# Altium schematic sheet RevisionHistory.SchDoc: Evaluation Board 3.2
size A3; Organization: Toradex AG; Address1: Altsagenstrasse 5; Address2: Horw; Address3: 6048; Address4: Switzerland; DocumentNumber: 1; Revision: V3.2; SheetNumber: 1; SheetTotal: 23
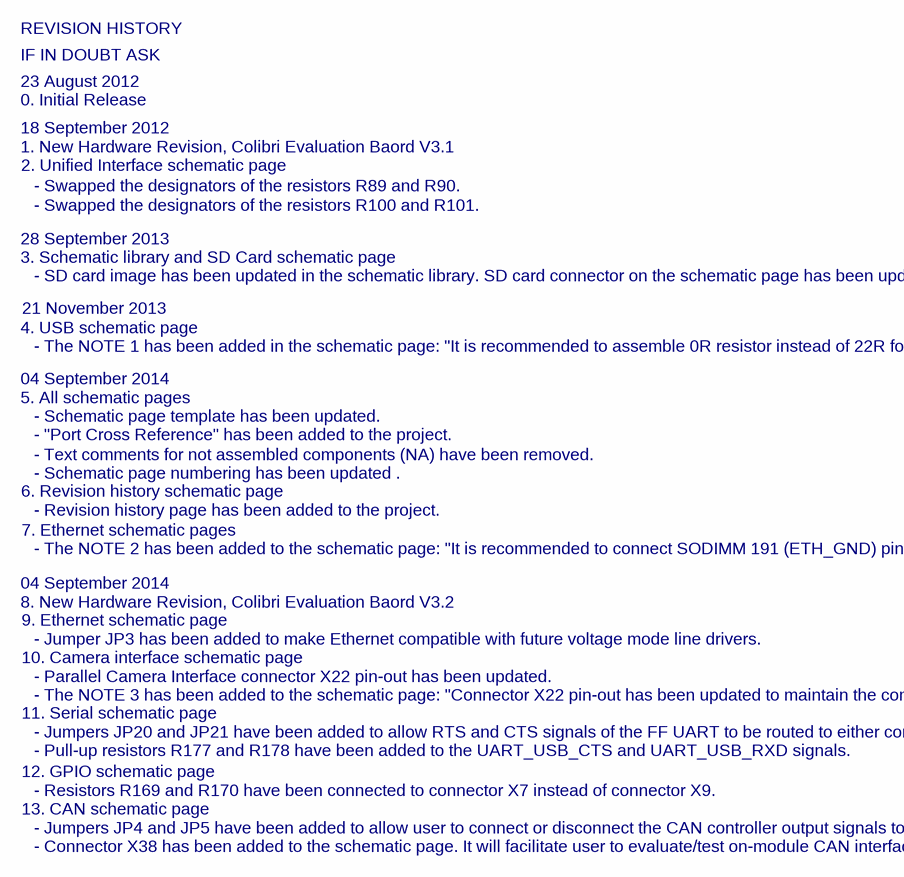
[diagram p0: RevisionHistory.SchDoc]

## Notes on the sheet
- REVISION HISTORY
- IF IN DOUBT ASK
- 0. Initial Release
- 18 September 2012
- 23 August 2012
- 1. New Hardware Revision, Colibri Evaluation Baord V3.1
- 2. Unified Interface schematic page
- - Swapped the designators of the resistors R89 and R90.
- 28 September 2013
- 3. Schematic library and SD Card schematic page
- - Swapped the designators of the resistors R100 and R101.
- 4. USB schematic page
- 21 November 2013
- - SD card image has been updated in the schematic library. SD card connector on the schematic page has been updated to reflect the library changes.
- 04 September 2014
- 5. All schematic pages
- - The NOTE 1 has been added in the schematic page: "It is recommended to assemble 0R resistor instead of 22R for R102 and R103".
- - Schematic page template has been updated.
- - "Port Cross Reference" has been added to the project.
- - Text comments for not assembled components (NA) have been removed.
- 6. Revision history schematic page
- 7. Ethernet schematic pages
- - Revision history page has been added to the project.
- - Schematic page numbering has been updated .
- 8. New Hardware Revision, Colibri Evaluation Baord V3.2
- - The NOTE 2 has been added to the schematic page: "It is recommended to connect SODIMM 191 (ETH_GND) pin directly to the GND".
- 9. Ethernet schematic page
- 10. Camera interface schematic page
- - Jumper JP3 has been added to make Ethernet compatible with future voltage mode line drivers.
- 11. Serial schematic page
- - Jumpers JP20 and JP21 have been added to allow RTS and CTS signals of the FF UART to be routed to either connector X27 or connector X25.
- - Parallel Camera Interface connector X22 pin-out has been updated.
- - The NOTE 3 has been added to the schematic page: "Connector X22 pin-out has been updated to maintain the compatibility with Apalis Evaluation Board".
- 12. GPIO schematic page
- - Resistors R169 and R170 have been connected to connector X7 instead of connector X9.
- - Pull-up resistors R177 and R178 have been added to the UART_USB_CTS and UART_USB_RXD signals.
- 13. CAN schematic page
- - Jumpers JP4 and JP5 have been added to allow user to connect or disconnect the CAN controller output signals to the CAN transceiver.
- - Connector X38 has been added to the schematic page. It will facilitate user to evaluate/test on-module CAN interface.
- Title
- Size:
- Date:
- A3
- Number:
- Time:
- Revision:
- Sheet
- of
- File: